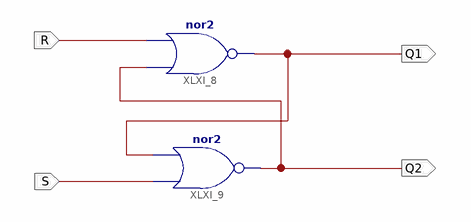
[diagram p0: schematic sheet 1]
// Xilinx ISE schematic lab7_experiment1.sch (spartan3e) as structural Verilog: 2 symbols, 4 ports
module lab7_experiment1 (
  input  R,
  input  S,
  output Q1,
  output Q2
);

  nor XLXI_8 (Q1, Q2, R);
  nor XLXI_9 (Q2, S, Q1);
endmodule
